# Altium project ummugul.PrjPcb
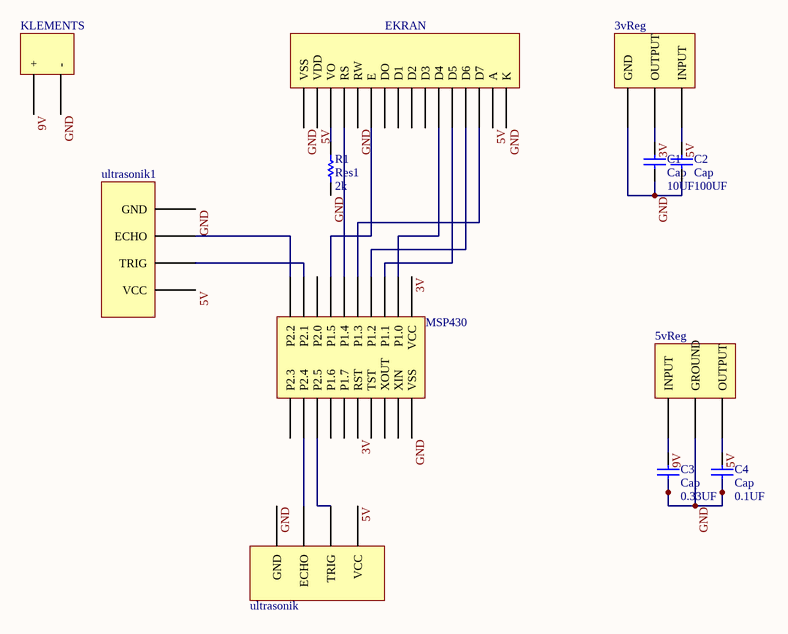
[diagram p0: sematik.SchDoc]
1 sheet, 12 parts. Net scope: global (net labels, ports and power ports of the same name join across sheets).
Board file: pcb_ummugul.PcbDoc

## Sheet sematik.SchDoc
size A4

### Parts
3vReg  LM1117  [3v3regulatorum_]  (value not drawn)
5vReg  LM7805  [5vregulatorum_]  (value not drawn)
C1  Cap  value 10UF  [RAD-0.3]
C2  Cap  value 100UF  [RAD-0.3]
C3  Cap  value 0.33UF  [RAD-0.3]
C4  Cap  value 0.1UF  [RAD-0.3]
EKRAN  EKRAN  [EKRAN - duplicate]
KLEMENTS  KLEMENTS  [klements]  (value not drawn)
MSP430  MSP430  [msp430]  (value not drawn)
R1  Res1  value 2k  [AXIAL-0.3]
ultrasonik  ultrasonik  [ultrasonik]  (value not drawn)
ultrasonik1  ultrasonik  [ultrasonik]  (value not drawn)

### Nets
3V: 3vReg.1(OUTPUT) C1.2 MSP430.1(VCC) MSP430.16(RST)
5V: 3vReg.2(INPUT) 5vReg.3(OUTPUT) C2.2 C4.2 EKRAN.2(VDD) EKRAN.15(A) ultrasonik.1(VCC) ultrasonik1.1(VCC)
9V: 5vReg.1(INPUT) C3.2 KLEMENTS.1(+)
GND: 3vReg.0(GND) 5vReg.2(GROUND) C1.1 C2.1 C3.1 C4.1 EKRAN.1(VSS) EKRAN.5(RW) EKRAN.16(K) KLEMENTS.2(-) MSP430.20(VSS) R1.1 ultrasonik.4(GND) ultrasonik1.4(GND)
NetEKRAN_3: EKRAN.3(VO) R1.2
NetEKRAN_4: EKRAN.4(RS) MSP430.6(P1.4)
NetEKRAN_6: EKRAN.6(E) MSP430.7(P1.5)
NetEKRAN_11: EKRAN.11(D4) MSP430.2(P1.0)
NetEKRAN_12: EKRAN.12(D5) MSP430.3(P1.1)
NetEKRAN_13: EKRAN.13(D6) MSP430.4(P1.2)
NetEKRAN_14: EKRAN.14(D7) MSP430.5(P1.3)
NetMSP430_9: MSP430.9(P2.1) ultrasonik1.2(TRIG)
NetMSP430_10: MSP430.10(P2.2) ultrasonik1.3(ECHO)
NetMSP430_12: MSP430.12(P2.4) ultrasonik.3(ECHO)
NetMSP430_13: MSP430.13(P2.5) ultrasonik.2(TRIG)

Not connected (* = marked no-connect by the designer): EKRAN 7(DO) 8(D1) 9(D2) 10(D3); MSP430 8(P2.0) 11(P2.3) 14(P1.6) 15(P1.7) 17(TST) 18(XOUT) 19(XIN)

### Library data of the parts
C1-C4 = Cap: Capacitor; Published: 8-Jun-2000; LatestRevisionDate: 17-Jul-2002; LatestRevisionNote: Re-released for DXP Platform.; PackageReference: RAD-0.3; Publisher: Altium Limited; PackageDescription: Radial Cap, Thru-Hole; 2 Leads; 0.3 in Pin Spacing
R1 = Res1: Resistor; Published: 8-Jun-2000; LatestRevisionDate: 17-Jul-2002; LatestRevisionNote: Re-released for DXP Platform.; PackageReference: AXIAL-0.3; Publisher: Altium Limited; PackageDescription: Axial Device, Thru-Hole; 2 Leads; 0.3 in Pin Spacing